# Altium schematic sheet CNC.SchDoc
size A2
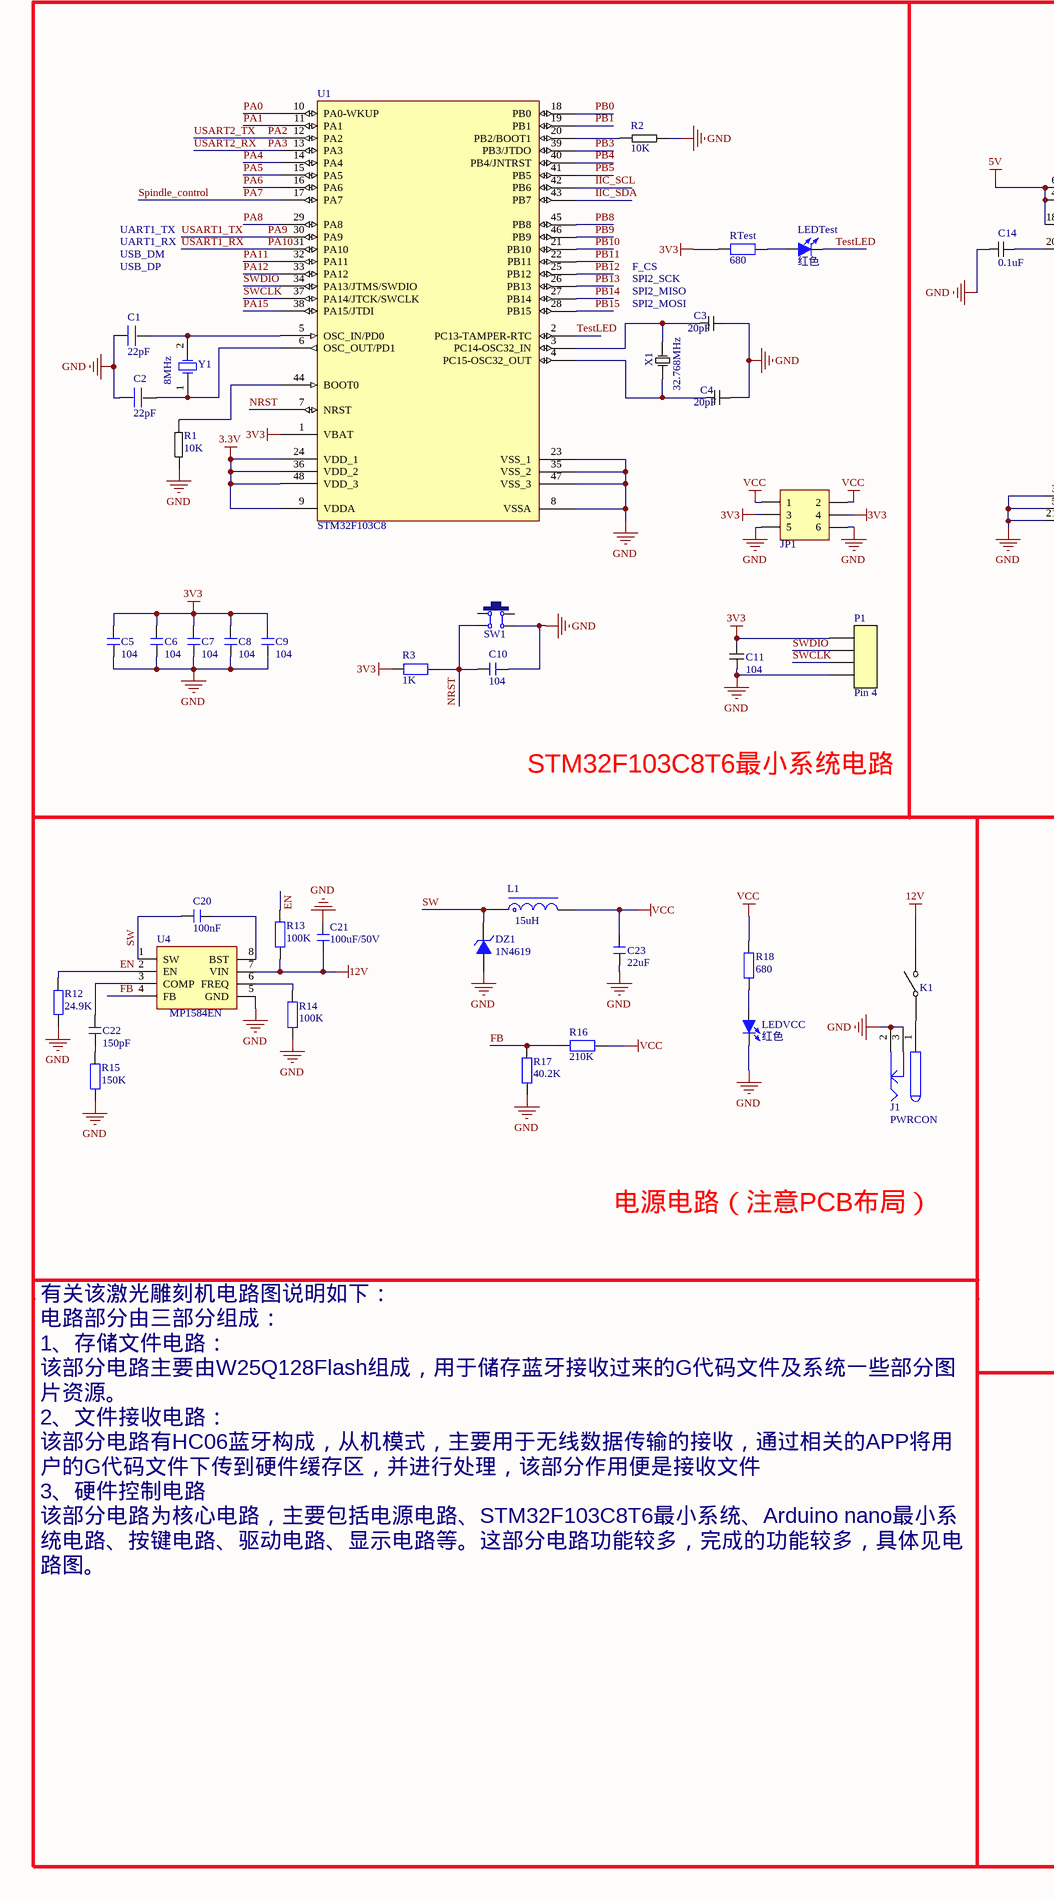
[diagram p0: CNC.SchDoc, left]
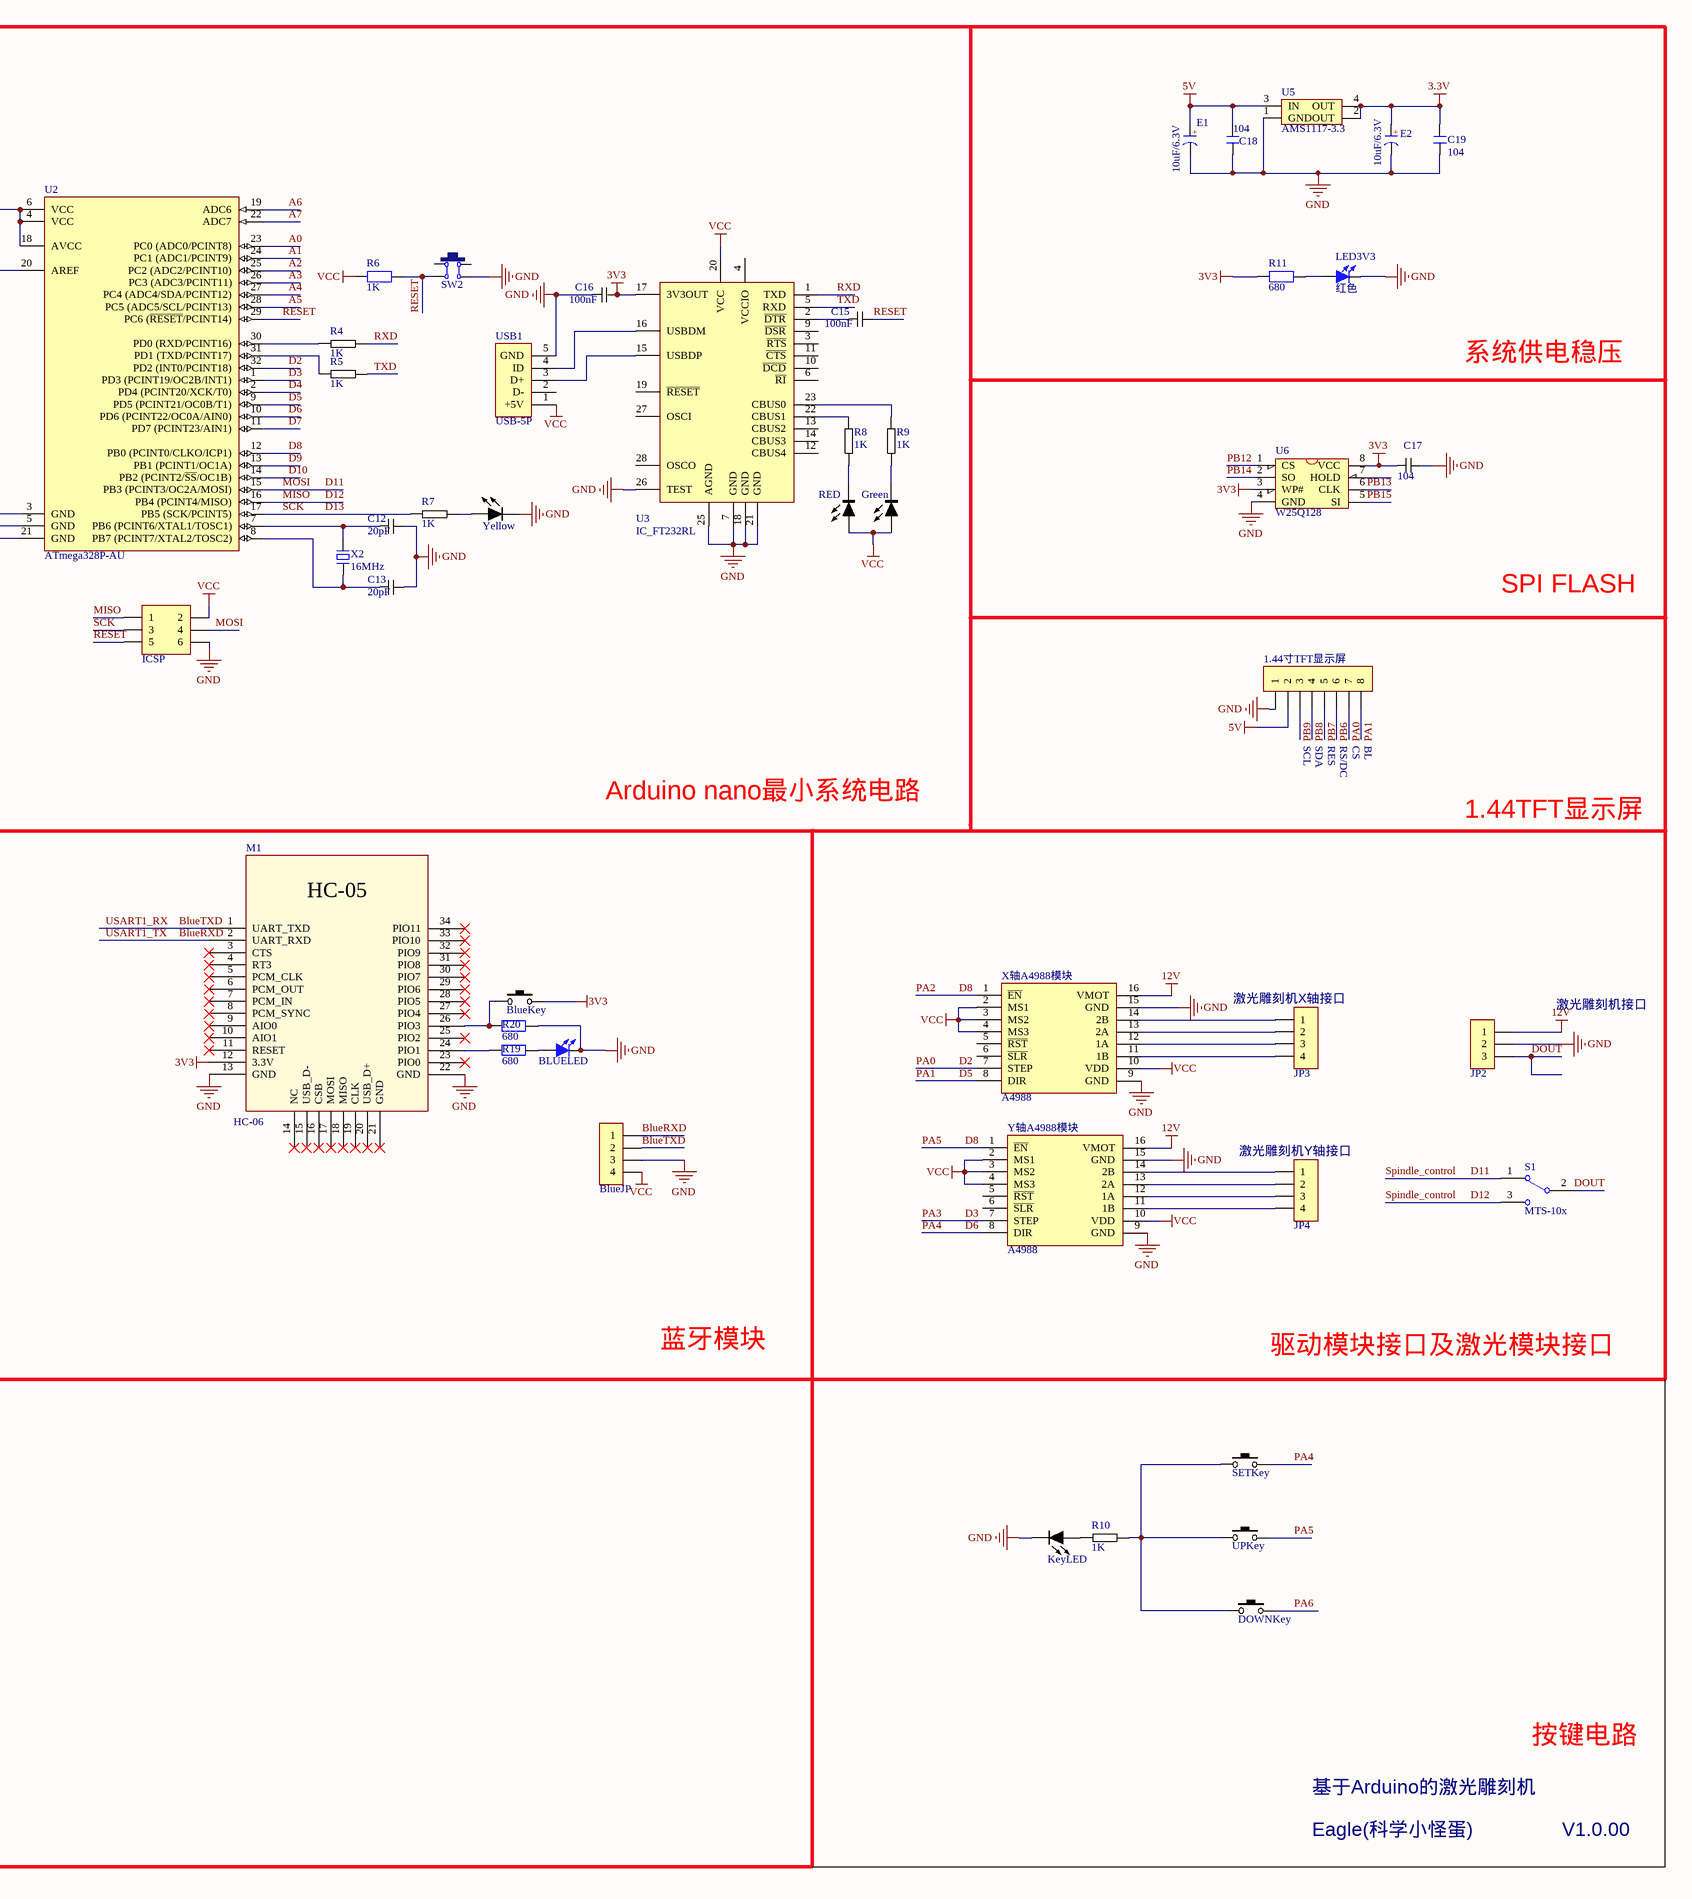
[diagram p1: CNC.SchDoc, right]

## Parts
1.44寸TFT显示屏  HDR-1X8  [HDR2.54-Y-LI-8P]  (value not drawn)
BlueJP  HDR-1X4  [XH2.54-WI-4P]  (value not drawn)
BlueKey  Key  [SW-PB]  (value not drawn)
BLUELED  红色  [LED 0805R]  (value not drawn)
C1  22pF  [0603P]
C2  22pF  [0603P]
C3  cap  [C0805]  (value not drawn)
C4  cap  [C0805]  (value not drawn)
C5  104  [C 0805_L]
C6  104  [C 0805_L]
C7  104  [C 0805_L]
C8  104  [C 0805_L]
C9  104  [C 0805_L]
C10  104  [C 0805_L]
C11  cap  [C0805]  (value not drawn)
C12  cap  [C0805]  (value not drawn)
C13  cap  [C0805]  (value not drawn)
C14  cap  [C0805]  (value not drawn)
C15  cap  [C0805]  (value not drawn)
C16  cap  [C0805]  (value not drawn)
C17  cap  [C0805]  (value not drawn)
C18  104  [C 0805_L]
C19  104  [C 0805_L]
C20  100nF  [C 0805_L]
C21  100uF/50V  [C 0805_L]
C22  150pF  [C 0805_L]
C23  22uF  [C 0805_L]
DOWNKey  Key  [SW-PB]  (value not drawn)
DZ1  1N4619  [DO-35]
E1  10uF/6.3V  [CD A(3216)]
E2  10uF/6.3V  [CD A(3216)]
Green  LED  [LED0805]  (value not drawn)
ICSP  Header3X2  [IDC2.54-LI-2x3P]  (value not drawn)
J1  PWRCON  [DC-005]
JP1  Header3X2  [IDC2.54-LI-2x3P]  (value not drawn)
JP2  HDR-1X3  [XH2.54-WI-3P]  (value not drawn)
JP3  HDR-1X4  [XH2.54-WI-4P]  (value not drawn)
JP4  HDR-1X4  [XH2.54-WI-4P]  (value not drawn)
K1  SW  [SWITCH DPDT]  (value not drawn)
KeyLED  LED  [LED0805]  (value not drawn)
L1  15uH  [CDRH74]
LED3V3  红色  [LED 0805R]
LEDTest  红色  [LED 0805R]
LEDVCC  红色  [LED 0805R]
M1  HC-06  [HC-05]
P1  Pin 4  [HDR2.54-1X4]
R1  Res  [R0805]  (value not drawn)
R2  Res  [R0805]  (value not drawn)
R3  1K  [R 0805_L]
R4  Res  [R0805]  (value not drawn)
R5  Res  [R0805]  (value not drawn)
R6  1K  [R 0805_L]
R7  Res  [R0805]  (value not drawn)
R8  Res  [R0805]  (value not drawn)
R9  Res  [R0805]  (value not drawn)
R10  Res  [R0805]  (value not drawn)
R11  680  [R 0805_L]
R12  24.9K  [0805]
R13  100K  [R 0805_L]
R14  100K  [R 0805_L]
R15  150K  [R 0805_L]
R16  210K  [R 0805_L]
R17  40.2K  [R 0805_L]
R18  680  [R 0805_L]
R19  680  [R 0805_L]
R20  680  [R 0805_L]
RED  LED  [LED0805]  (value not drawn)
RTest  680  [R 0805_L]
S1  MTS-10x  [MTS-10x]
SETKey  Key  [SW-PB]  (value not drawn)
SW1  12x12x5  [TSW SMD-12*12*4.3]  (value not drawn)
SW2  12x12x5  [TSW SMD-12*12*4.3]  (value not drawn)
U1  STM32F103C8  [LQFP48 7X7_M]
U2  ATmega328P-AU  [32A_N]
U3  IC_FT232RL  [SSOP-28]
U4  MP1584EN  [SOP8]
U5  AMS1117-3.3  [AMS1117]
U6  W25Q128  [SOIC-8]
UPKey  Key  [SW-PB]  (value not drawn)
USB1  USB-5P  [USB-MINI-A]
X1  cap  [XTAL-32.768]  (value not drawn)
X2  16MHz  [OSC 6035-2P]
X轴A4988模块  A4988  [DFPlayer Mini]
Y1  8MHz  [XTAL_US]
Yellow  LED  [LED0805]  (value not drawn)
Y轴A4988模块  A4988  [DFPlayer Mini]

## Blocks framed on the sheet
STM32F103C8T6最小系统电路: C1-C11 JP1 LEDTest P1 R1-R3 RTest SW1 U1 X1 Y1

## Nets
3.3V: C19.2 E2.1(A) U1.9(VDDA) U1.24(VDD_1) U1.36(VDD_2) U1.48(VDD_3) U5.2(OUT) U5.4(OUT)
3V3: BlueKey.3 C5.2 C6.2 C7.2 C8.2 C9.2 C11.1 C16.2 C17.1 JP1.3 JP1.4 M1.12(3.3V) P1.1 R3.2 R11.2 RTest.2 U1.1(VBAT) U3.17(3V3OUT) U6.3(WP#) U6.8(VCC)
5V: 1.44寸TFT显示屏.2 C18.2 E1.1(A) U2.4(VCC) U2.6(VCC) U2.18(AVCC) U5.3(IN)
12V: C21.2 JP2.1 K1.1(NO) R13.2 U4.7(VIN) X轴A4988模块.16(VMOT) Y轴A4988模块.16(VMOT)
GND: 1.44寸TFT显示屏.1 BlueJP.3 BLUELED.2(K) C1.1 C2.1 C3.2 C4.2 C5.1 C6.1 C7.1 C8.1 C9.1 C10.1 C11.2 C12.2 C13.2 C14.1 C16.1 C17.2 C18.1 C19.1 C21.1 C23.1 DZ1.1(A) E1.2(K) E2.2(K) ICSP.6 J1.2 J1.3 JP1.5 JP1.6 JP2.2 KeyLED.K LED3V3.2(K) LEDVCC.2(K) M1.13(GND) M1.22(GND) P1.4 R1.1 R2.2 R12.1 R14.1 R15.1 R17.2 R20.1 SW1.3 SW2.3 U1.8(VSSA) U1.23(VSS_1) U1.35(VSS_2) U1.47(VSS_3) U2.3(GND) U2.5(GND) U2.21(GND) U3.7(GND) U3.18(GND) U3.21(GND) U3.25(AGND) U3.26(TEST) U4.5(GND) U5.1(GND) U6.4(GND) USB1.5(GND) X轴A4988模块.9(GND) X轴A4988模块.15(GND) Yellow.K Y轴A4988模块.9(GND) Y轴A4988模块.15(GND)
NC: U3.8(NC) U3.24(NC)
VCC: BlueJP.4 C23.2 Green.A ICSP.2 JP1.1 JP1.2 L1.2 R6.2 R16.2 R18.2 RED.A U3.20(VCC) USB1.1(+5V) X轴A4988模块.2(MS1) X轴A4988模块.3(MS2) X轴A4988模块.4(MS3) X轴A4988模块.10(VDD) Y轴A4988模块.2(MS1) Y轴A4988模块.3(MS2) Y轴A4988模块.4(MS3) Y轴A4988模块.10(VDD)
A0: U2.23(PC0_(ADC0/PCINT8))
A1: U2.24(PC1_(ADC1/PCINT9))
A2: U2.25(PC2_(ADC2/PCINT10))
A3: U2.26(PC3_(ADC3/PCINT11))
A4: U2.27(PC4_(ADC4/SDA/PCINT12))
A5: U2.28(PC5_(ADC5/SCL/PCINT13))
A6: U2.19(ADC6)
A7: U2.22(ADC7)
BlueRXD: BlueJP.1 M1.2(UART_RXD) U1.30(PA9)  [also labelled PA9, USART1_TX]
BlueTXD: BlueJP.2 M1.1(UART_TXD) U1.31(PA10)  [also labelled PA10, USART1_RX]
D2: 1.44寸TFT显示屏.7 U1.10(PA0-WKUP) U2.32(PD2_(INT0/PCINT18)) X轴A4988模块.7(STEP)  [also labelled PA0]
D3: U1.13(PA3) U2.1(PD3_(PCINT19/OC2B/INT1)) Y轴A4988模块.7(STEP)  [also labelled PA3, USART2_RX]
D4: U2.2(PD4_(PCINT20/XCK/T0))
D5: 1.44寸TFT显示屏.8 U1.11(PA1) U2.9(PD5_(PCINT21/OC0B/T1)) X轴A4988模块.8(DIR)  [also labelled PA1]
D6: SETKey.3 U1.14(PA4) U2.10(PD6_(PCINT22/OC0A/AIN0)) Y轴A4988模块.8(DIR)  [also labelled PA4]
D7: U2.11(PD7_(PCINT23/AIN1))
D8: U1.12(PA2) U1.15(PA5) U2.12(PB0_(PCINT0/CLKO/ICP1)) UPKey.3 X轴A4988模块.1(~{EN}) Y轴A4988模块.1(~{EN})  [also labelled PA2, PA5, USART2_TX]
D9: U2.13(PB1_(PCINT1/OC1A))
D10: U2.14(PB2_(PCINT2/~{SS}/OC1B))
D11: ICSP.1 ICSP.4 S1.1 S1.3 U1.17(PA7) U2.15(PB3_(PCINT3/OC2A/MOSI)) U2.16(PB4_(PCINT4/MISO))  [also labelled D12, MISO, MOSI, PA7, Spindle_control]
D13: ICSP.3 R7.1 U2.17(PB5_(SCK/PCINT5))  [also labelled SCK]
DOUT: JP2.3 S1.2
EN: R12.2 R13.1 U4.2(EN)
FB: R16.1 R17.1 U4.4(FB)
IIC_SCL: U1.42(PB6)
IIC_SDA: U1.43(PB7)
NRST: C10.2 R3.1 SW1.4 U1.7(NRST)
PA6: DOWNKey.3 U1.16(PA6)
PA8: U1.29(PA8)
PA11: U1.32(PA11)
PA12: U1.33(PA12)
PA15: U1.38(PA15/JTDI)
PB0: U1.18(PB0)
PB1: U1.19(PB1)
PB3: U1.39(PB3/JTDO)
PB4: U1.40(PB4/JNTRST)
PB5: U1.41(PB5)
PB6: 1.44寸TFT显示屏.6
PB7: 1.44寸TFT显示屏.5
PB8: 1.44寸TFT显示屏.4 U1.45(PB8)
PB9: 1.44寸TFT显示屏.3 U1.46(PB9)
PB10: U1.21(PB10)
PB11: U1.22(PB11)
PB12: U1.25(PB12) U6.1(CS)
PB13: U1.26(PB13) U6.6(CLK)
PB14: U1.27(PB14) U6.2(SO)
PB15: U1.28(PB15) U6.5(SI)
RESET: C15.2 ICSP.5 R6.1 SW2.4 U2.29(PC6_(~{RESET}/PCINT14))
RXD: R4.2 U3.1(TXD)
SW: C20.1 DZ1.2(K) L1.1 U4.1(SW)
SWCLK: P1.3 U1.37(PA14/JTCK/SWCLK)
SWDIO: P1.2 U1.34(PA13/JTMS/SWDIO)
TestLED: LEDTest.2(K) U1.2(PC13-TAMPER-RTC)
TXD: R5.2 U3.5(RXD)
NetBlueKey_1: BlueKey.1 M1.26(PIO3) R20.2
NetBLUELED_1: BLUELED.1(A) R19.1
NetC1_2: C1.2 U1.5(OSC_IN/PD0) Y1.2(OSC2)
NetC2_2: C2.2 U1.6(OSC_OUT/PD1) Y1.1(OSC1)
NetC3_1: C3.1 U1.3(PC14-OSC32_IN) X1.2
NetC4_1: C4.1 U1.4(PC15-OSC32_OUT) X1.1
NetC12_1: C12.1 U2.7(PB6_(PCINT6/XTAL1/TOSC1)) X2.2
NetC13_1: C13.1 U2.8(PB7_(PCINT7/XTAL2/TOSC2)) X2.1
NetC14_2: C14.2 U2.20(AREF)
NetC15_1: C15.1 U3.2(~{DTR})
NetC20_2: C20.2 U4.8(BST)
NetC22_1: C22.1 R15.2
NetC22_2: C22.2 U4.3(COMP)
NetDOWNKey_1: DOWNKey.1 R10.2 SETKey.1 UPKey.1
NetGreen_K: Green.K R9.1
NetJ1_1: J1.1 K1.2(COMMON)
NetJP3_1: JP3.1 X轴A4988模块.14(2B)
NetJP3_2: JP3.2 X轴A4988模块.13(2A)
NetJP3_3: JP3.3 X轴A4988模块.12(1A)
NetJP3_4: JP3.4 X轴A4988模块.11(1B)
NetJP4_1: JP4.1 Y轴A4988模块.14(2B)
NetJP4_2: JP4.2 Y轴A4988模块.13(2A)
NetJP4_3: JP4.3 Y轴A4988模块.12(1A)
NetJP4_4: JP4.4 Y轴A4988模块.11(1B)
NetKeyLED_A: KeyLED.A R10.1
NetLED3V3_1: LED3V3.1(A) R11.1
NetLEDTest_1: LEDTest.1(A) RTest.1
NetLEDVCC_1: LEDVCC.1(A) R18.1
NetM1_24: M1.24(PIO1) R19.2
NetR1_2: R1.2 U1.44(BOOT0)
NetR2_1: R2.1 U1.20(PB2/BOOT1)
NetR4_1: R4.1 U2.30(PD0_(RXD/PCINT16))
NetR5_1: R5.1 U2.31(PD1_(TXD/PCINT17))
NetR7_2: R7.2 Yellow.A
NetR8_1: R8.1 RED.K
NetR8_2: R8.2 U3.22(CBUS1)
NetR9_2: R9.2 U3.23(CBUS0)
NetR14_2: R14.2 U4.6(FREQ)
NetU3_15: U3.15(USBDP) USB1.3(D+)
NetU3_16: U3.16(USBDM) USB1.4(ID)

Not connected (* = marked no-connect by the designer): M1 3(CTS)* 4(RT3)* 5(PCM_CLK)* 6(PCM_OUT)* 7(PCM_IN)* 8(PCM_SYNC)* 9(AIO0)* 10(AIO1)* 11(RESET)* 14(NC)* 15(USB_D-)* 16(CSB)* 17(MOSI)* 18(MISO)* 19(CLK)* 20(USB_D+)* 21(GND)* 23(PIO0)* 25(PIO2)* 27(PIO4)* 28(PIO5)* 29(PIO6)* 30(PIO7)* 31(PIO8)* 32(PIO9)* 33(PIO10)* 34(PIO11)*; SW1 1 2; SW2 1 2; U3 3(~{RTS}) 4(VCCIO) 6(~{RI}) 9(~{DSR}) 10(~{DCD}) 11(~{CTS}) 12(CBUS4) 13(CBUS2) 14(CBUS3) 19(~{RESET}) 27(OSCI) 28(OSCO); U6 7(HOLD); USB1 2(D-); X轴A4988模块 5(~{RST}) 6(~{SLR}); Y轴A4988模块 5(~{RST}) 6(~{SLR})

## Notes on the sheet
- UART1_TX
- UART1_RX
- USB_DM
- USB_DP
- F_CS
- SPI2_SCK
- SPI2_MISO
- SPI2_MOSI
- 系统供电稳压
- SPI FLASH
- SCL
- SDA
- RES
- RS/DC
- CS
- BL
- Arduino nano最小系统电路
- 1.44TFT显示屏
- (near JP3) 激光雕刻机X轴接口
- (near JP2) 激光雕刻机接口
- (near JP4) 激光雕刻机Y轴接口
- 电源电路（注意PCB布局）
- 蓝牙模块
- 驱动模块接口及激光模块接口
- 基于Arduino的激光雕刻机
- 按键电路
- 有关该激光雕刻机电路图说明如下：
  电路部分由三部分组成：
  1、存储文件电路：
  该部分电路主要由W25Q128Flash组成，用于储存蓝牙接收过来的G代码文件及系统一些部分图片资源。
  2、文件接收电路：
  该部分电路有HC06蓝牙构成，从机模式，主要用于无线数据传输的接收，通过相关的APP将用户的G代码文件下传到硬件缓存区，并进行处理，该部分作用便是接收文件
  3、硬件控制电路
  该部分电路为核心电路，主要包括电源电路、STM32F103C8T6最小系统、Arduino nano最小系统电路、按键电路、驱动电路、显示电路等。这部分电路功能较多，完成的功能较多，具体见电路图。
- Eagle(科学小怪蛋)
- V1.0.00
- (in symbol C-CD) +
- (in symbol Cap) 20pF; 104; 0.1uF; 100nF
- (in symbol Crystal) 32.768MHz
- (in symbol Res) 10K; 1K

## Library data of the parts
1.44寸TFT显示屏 = Header 8: 8P接插件; 版权归属: 源创客; BOM名称: 8P接插件; 学习资源: www.ooocke.com
BlueJP JP3 JP4 = Header 4: 4P接插件; 版权归属: 源创客; BOM名称: 4P接插件; 学习资源: www.ooocke.com
BlueKey DOWNKey SETKey UPKey = Key: 按键
BLUELED LED3V3 LEDTest LEDVCC = LED-SMD: 贴片LED; 版权归属: 源创客; BOM名称: 贴片LED; 学习资源: www.ooocke.com
C1 C2 = C
C3 C4 C11-C17 = Cap: 电容
C5-C10 C18-C23 = C: 无极性贴片电容; 版权归属: 源创客; BOM名称: 无极性贴片电容; 学习资源: www.ooocke.com
DZ1 = 1N4619: 3V/0.5W稳压管; 版权归属: 源创客; BOM名称: 3V/0.5W稳压管; 学习资源: www.ooocke.com
E1 E2 = C-CD: 贴片钽电容; 版权归属: 源创客; BOM名称: 贴片钽电容; 学习资源: www.ooocke.com
Green KeyLED RED Yellow = LED: 发光二极管
ICSP JP1 = Header 3X2: 3*2P接插件; 版权归属: 源创客; BOM名称: 3*2P接插件; 学习资源: www.ooocke.com
J1 = PWRCON: 直流电源端子; Published: 17-Dec-2003; DatasheetDocument: 09-May-2002; Publisher: Altium Limited; ComponentLink1Description: Manufacturer Link; ComponentLink1URL: http://domino.kycon.com/internet/Products.html
JP2 = Header 3: 3P接插件; 版权归属: 源创客; BOM名称: 3P接插件; 学习资源: www.ooocke.com
K1 = SW: 六角开关
L1 = L-CDRH: 功率屏蔽电感; 版权归属: 源创客; BOM名称: 功率屏蔽电感; 学习资源: www.ooocke.com
M1 = HC-05: 串口蓝牙模块; 版权归属: 源创客; BOM名称: 串口蓝牙模块; 学习资源: www.ooocke.com
P1 = Pin 4: 接插件
R1 R2 R4 R5 R7-R10 = Res: 电阻
R3 R6 R11 R13-R20 RTest = R: 贴片电阻; 版权归属: 源创客; BOM名称: 贴片电阻; 学习资源: www.ooocke.com
R12 = R
S1 = MTS-10x: MTS10x系列3脚扭子开关; 版权归属: 源创客; BOM名称: MTS10x系列3脚扭子开关; 学习资源: www.ooocke.com
SW1 SW2 = TSW SMD-12x12: 贴片12x12轻触开关; 版权归属: 源创客; BOM名称: 贴片12x12轻触开关; 学习资源: www.ooocke.com
U1 = STM32F103C8: Flaah:64/RAM:20/IO:36; BOM名称: 32位STM单片机; 版权归属: 源创客; 学习资源: www.ooocke.com
U2 = ATmega328P-AU: 8-bit AVR Microcontroller, 32KB Flash, 1KB EEPROM, 2KB SRAM, 32-pin TQFP, Industrial Grade (-40癈 to 85癈); Published: 1-Apr-2010; DatasheetVersion: revA, Jan-2010; PackageVersion: revB, Oct-2001; PackageReference: 32A; Publisher: Altium Limited; PackageDescription: 32-Lead, 7x7x1.0 mm Body, 0.8mm Lead Pitch, Thin Profile Plastic Quad Flat Package (TQFP); Supplier 1: Digi-Key; Supplier Part Number 1: ATMEGA328P-AU-ND; Supplier 2: Farnell; Supplier Part Number 2: 1715486; Supplier 3: Mouser; Supplier Part Number 3: 556-ATMEGA328P-AU; Code_JEDEC: MS-026-ABA; ComponentLink1Description: Manufacturer Link; ComponentLink1URL: http://www.atmel.com/products/avr/default.asp?; ComponentLink2Description: ATmega48A/48PA/88A/88PA/168A/168PA/328/328P Datasheet; ComponentLink2URL: http://www.atmel.com/dyn/resources/prod_documents/8271.pdf; ComponentLink3Description: ATmega48A/48PA/88A/88PA/168A/168PA/328/328P Summary; ComponentLink3URL: http://www.atmel.com/dyn/resources/prod_documents/8271S.pdf; ComponentLink4Description: Atmel.com Home; ComponentLink4URL: http://www.atmel.com
U3 = IC_FT232RL: FT232R USB UART; Manufacturer: *; Note: *; ManufacturerPartNo: *
U4 = DS1302
U5 = AMS1117
U6 = W25X16: W25X16;SST25VF016;MX25L1605
USB1 = USB-5P: 微型USB母座; 版权归属: 源创客; BOM名称: 微型USB母座; 学习资源: www.ooocke.com
X1 = Crystal: 石英晶体
X2 = XTAL-2P: 2脚无源脚晶振; 版权归属: 源创客; BOM名称: 2脚无源脚晶振; 学习资源: www.ooocke.com
X轴A4988模块 Y轴A4988模块 = Mini MP3 Player: MP3模块; 版权归属: 源创客; BOM名称: MP3模块; 学习资源: www.ooocke.com
Y1 = XTAL: Crystal Oscillator; Published: 8-Jun-2000; LatestRevisionDate: 17-Jul-2002; LatestRevisionNote: Re-released for DXP Platform.; Publisher: Altium Limited